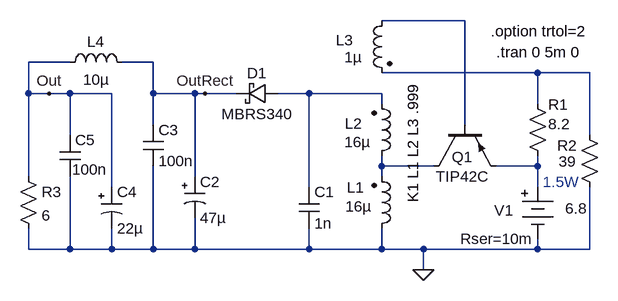
[diagram p0: schematic 6a12L.asc]
6a12L.asc, the LTspice schematic file:
Version 4
SHEET 1 880 680
WIRE -16 64 -144 64
WIRE -624 128 -688 128
WIRE -496 128 -544 128
WIRE 96 144 -144 144
WIRE 176 144 96 144
WIRE -688 176 -688 128
WIRE -656 176 -688 176
WIRE -624 176 -656 176
WIRE -560 176 -624 176
WIRE -496 176 -496 128
WIRE -432 176 -496 176
WIRE -416 176 -432 176
WIRE -368 176 -416 176
WIRE -256 176 -304 176
WIRE -144 176 -256 176
WIRE -144 192 -144 176
WIRE 96 192 96 144
WIRE -496 224 -496 176
WIRE -16 224 -16 64
WIRE -624 240 -624 176
WIRE 176 240 176 144
WIRE -144 288 -144 272
WIRE -64 288 -144 288
WIRE 96 288 96 272
WIRE 96 288 32 288
WIRE -688 304 -688 176
WIRE -432 304 -432 176
WIRE -144 304 -144 288
WIRE -560 320 -560 176
WIRE -256 320 -256 176
WIRE 96 320 96 288
WIRE -688 416 -688 384
WIRE -624 416 -624 304
WIRE -624 416 -688 416
WIRE -560 416 -560 384
WIRE -560 416 -624 416
WIRE -496 416 -496 288
WIRE -496 416 -560 416
WIRE -432 416 -432 368
WIRE -432 416 -496 416
WIRE -256 416 -256 384
WIRE -256 416 -432 416
WIRE -144 416 -144 384
WIRE -144 416 -256 416
WIRE -80 416 -144 416
WIRE 96 416 96 400
WIRE 96 416 -80 416
WIRE 176 416 176 320
WIRE 176 416 96 416
WIRE -80 448 -80 416
FLAG -80 448 0
FLAG -656 176 Out
FLAG -416 176 OutRect
SYMBOL ind2 -160 400 M180
WINDOW 0 -38 79 Left 0
WINDOW 3 -40 50 Left 0
SYMATTR InstName L1
SYMATTR Value 16µ
SYMATTR Type ind
SYMATTR SpiceLine Ipk=20 Rser=0.01 Rpar=0 Cpar=0
SYMBOL ind2 -160 288 M180
WINDOW 0 -41 66 Left 0
WINDOW 3 -42 37 Left 0
SYMATTR InstName L2
SYMATTR Value 16µ
SYMATTR Type ind
SYMATTR SpiceLine Ipk=20 Rser=0.01 Rpar=0 Cpar=0
SYMBOL ind2 -128 48 M0
WINDOW 0 60 46 Left 0
WINDOW 3 47 72 Left 0
SYMATTR InstName L3
SYMATTR Value 1µ
SYMATTR Type ind
SYMATTR SpiceLine Ipk=0.8 Rser=1m Rpar=0 Cpar=0
SYMBOL res 80 176 R0
WINDOW 0 32 17 Left 0
WINDOW 3 32 47 Left 0
SYMATTR InstName R1
SYMATTR Value 8.2
SYMATTR SpiceLine tol=1 pwr=0.1
SYMBOL res 160 224 R0
WINDOW 0 -34 32 Left 0
WINDOW 3 -32 57 Left 0
SYMATTR InstName R2
SYMATTR Value 39
SYMATTR SpiceLine tol=1 pwr=0.1
SYMBOL pnp2 -64 224 M90
WINDOW 0 50 60 VLeft 0
WINDOW 3 80 85 VLeft 0
SYMATTR InstName Q1
SYMATTR Value TIP42C
SYMBOL Misc\\battery 96 304 R0
WINDOW 123 0 0 Left 0
WINDOW 39 -119 96 Left 0
WINDOW 3 42 49 Left 0
WINDOW 0 -67 52 Left 0
SYMATTR SpiceLine Rser=10m
SYMATTR Value 6.8
SYMATTR InstName V1
SYMBOL schottky -304 160 R90
WINDOW 0 0 32 VBottom 0
WINDOW 3 32 32 VTop 0
SYMATTR InstName D1
SYMATTR Value MBRS340
SYMATTR Description Diode
SYMATTR Type diode
SYMBOL polcap -448 304 R0
WINDOW 3 24 64 Left 0
SYMATTR Value 47µ
SYMATTR InstName C2
SYMATTR Description Capacitor
SYMATTR Type cap
SYMATTR SpiceLine V=16 Irms=2.1 Rser=0.035 Lser=0 mfg="KEMET" pn="T525D476M016ATE035" type="Tantalum"
SYMBOL res -704 288 R0
SYMATTR InstName R3
SYMATTR Value 6
SYMATTR SpiceLine tol=1 pwr=0.1
SYMBOL cap -272 320 R0
SYMATTR InstName C1
SYMATTR Value 1n
SYMBOL cap -512 224 R0
SYMATTR InstName C3
SYMATTR Value 100n
SYMBOL ind -640 144 R270
WINDOW 0 32 56 VTop 0
WINDOW 3 5 56 VBottom 0
SYMATTR InstName L4
SYMATTR Value 10µ
SYMATTR SpiceLine Ipk=3 Rser=0.01 Rpar=29000 Cpar=32p mfg="Gowanda" pn="050AT1002V"
SYMBOL cap -640 240 R0
WINDOW 3 19 53 Left 0
SYMATTR Value 100n
SYMATTR InstName C5
SYMBOL polcap -576 320 R0
WINDOW 3 24 64 Left 0
SYMATTR Value 22µ
SYMATTR InstName C4
SYMATTR Description Capacitor
SYMATTR Type cap
SYMATTR SpiceLine V=20 Irms=0 Rser=0.225 Lser=0 mfg="KEMET" pn="T495D226M020AS" type="Tantalum"
TEXT -96 160 VRight 0 !K1 L1 L2 L3 .999
TEXT 32 112 Left 0 !.tran 0 5m 0
TEXT 24 80 Left 0 !.option trtol=2
TEXT 104 312 Left 0 ;1.5W

The netlist it stands for:
* 6a12L.asc
L1 0 N004 16µ Ipk=20 Rser=0.01 Rpar=0 Cpar=0
L2 N004 N003 16µ Ipk=20 Rser=0.01 Rpar=0 Cpar=0
L3 N001 N002 1µ Ipk=0.8 Rser=1m Rpar=0 Cpar=0
R1 N002 N005 8.2 tol=1 pwr=0.1
R2 N002 0 39 tol=1 pwr=0.1
Q1 N004 N001 N005 0 TIP42C
V1 N005 0 6.8 Rser=10m
D1 N003 OutRect MBRS340
C2 OutRect 0 47µ V=16 Irms=2.1 Rser=0.035 Lser=0 mfg="KEMET" pn="T525D476M016ATE035" type="Tantalum"
R3 Out 0 6 tol=1 pwr=0.1
C1 N003 0 1n
C3 OutRect 0 100n
L4 Out OutRect 10µ Ipk=3 Rser=0.01 Rpar=29000 Cpar=32p mfg="Gowanda" pn="050AT1002V"
C5 Out 0 100n
C4 Out 0 22µ V=20 Irms=0 Rser=0.225 Lser=0 mfg="KEMET" pn="T495D226M020AS" type="Tantalum"
.model D D
.lib standard.dio
.model NPN NPN
.model PNP PNP
.lib standard.bjt
K1 L1 L2 L3 .999
.tran 0 5m 0
.option trtol=2
* 1.5W
.backanno
.end